# EAGLE design pcb01_control (EAGLE 6.4)
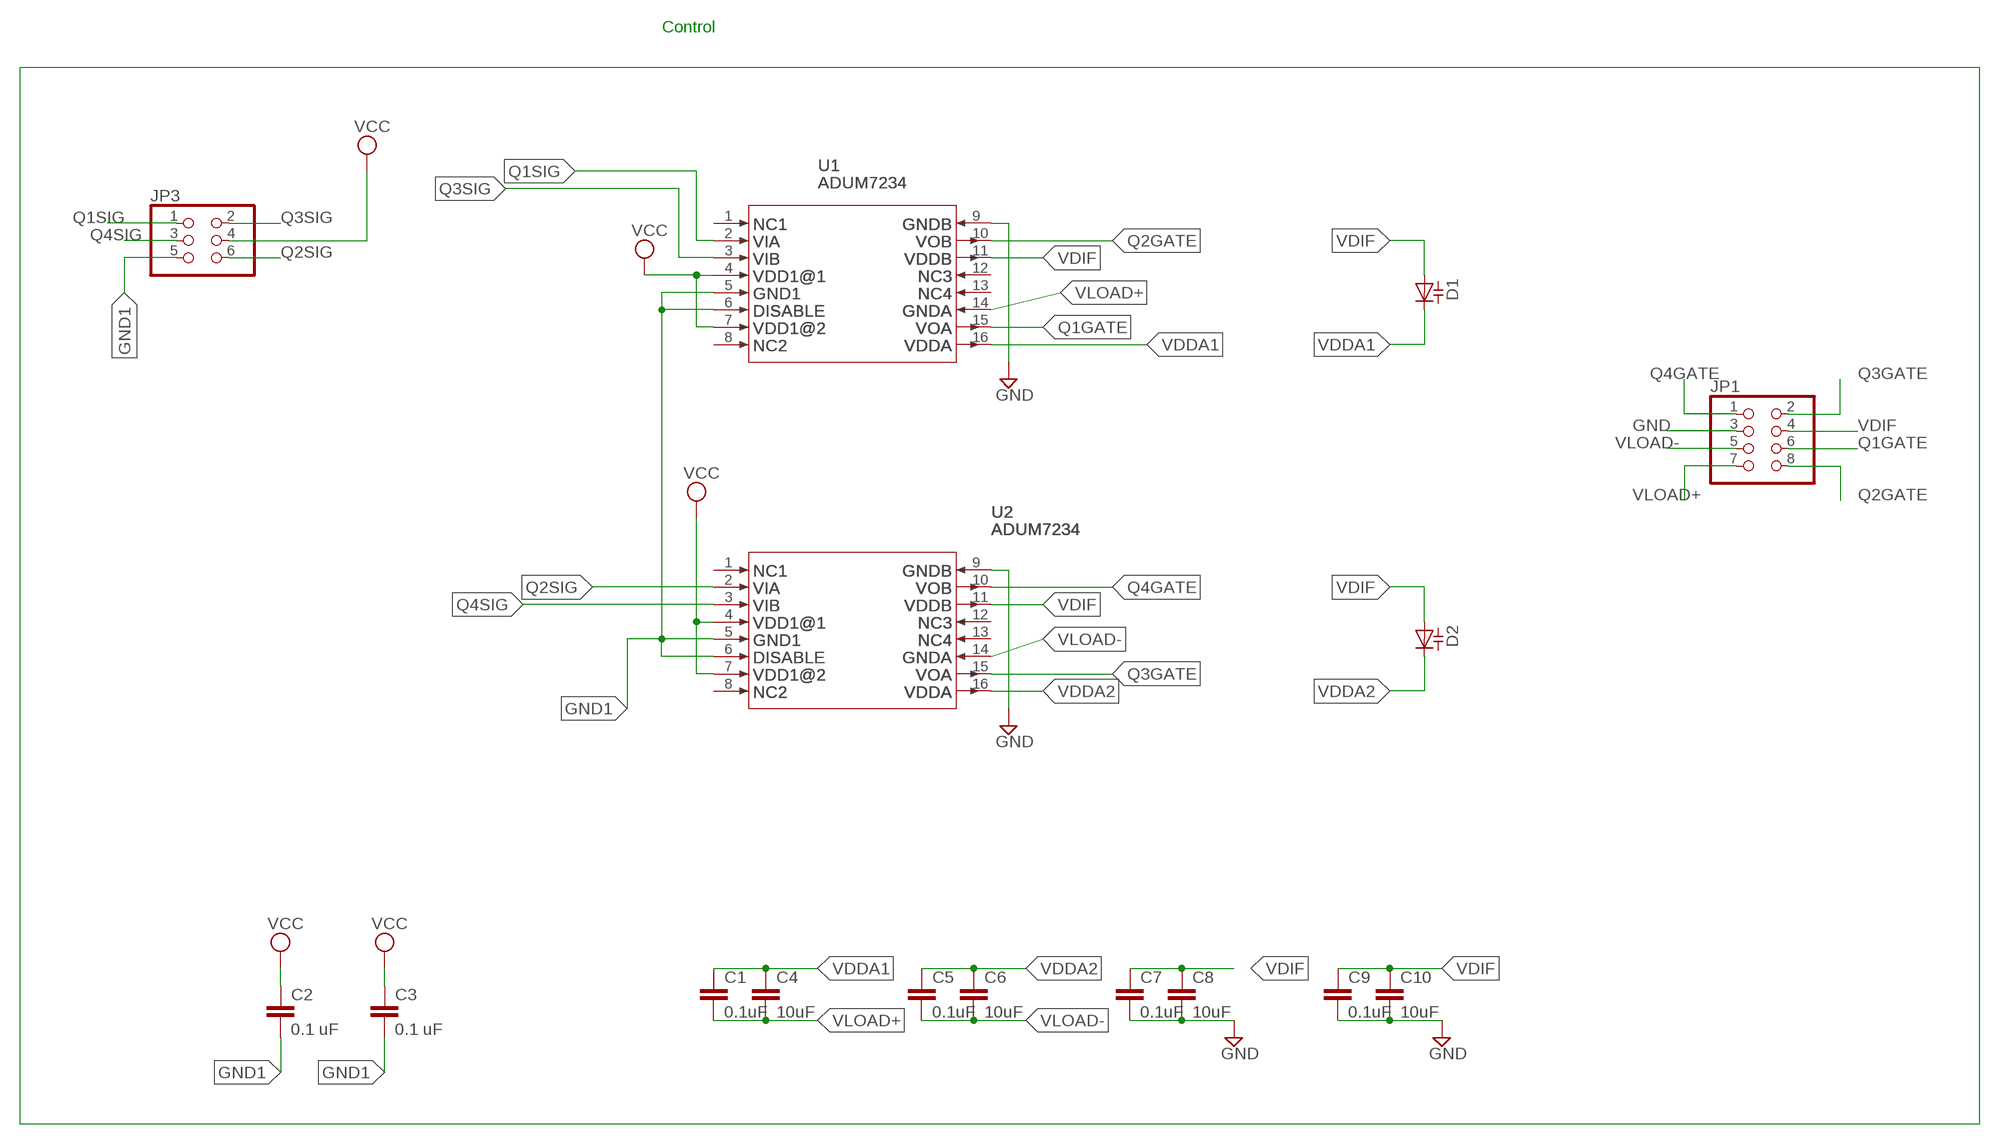
[diagram p0: schematic, sheet 1]

## Parts
C1  0.1uF  C-EUC0805  [C0805]
C2  0.1 uF  C-EUC0805  [C0805]
C3  0.1 uF  C-EUC0805  [C0805]
C4  10uF  C-EUC0805  [C0805]
C5  0.1uF  C-EUC0805  [C0805]
C6  10uF  C-EUC0805  [C0805]
C7  0.1uF  C-EUC0805  [C0805]
C8  10uF  C-EUC0805  [C0805]
C9  0.1uF  C-EUC0805  [C0805]
C10  10uF  C-EUC0805  [C0805]
D1  DIODE_CAPACITANCE-SOD523  [SOD523]
D2  DIODE_CAPACITANCE-SOD523  [SOD523]
JP1  PINHD-2X4  [2X04]
JP3  PINHD-2X3  [2X03]
U1  ADUM7234  [16_SOIC]
U2  ADUM7234  [16_SOIC]

## Nets
GND: C7.2 C8.2 C9.2 C10.2 JP1.3 U1.9 U2.9
GND1: C2.2 C3.2 JP3.5 U1.5 U1.6 U2.5 U2.6
Q1GATE: JP1.6 U1.15
Q1SIG: JP3.1 U1.2
Q2GATE: JP1.8 U1.10
Q2SIG: JP3.6 U2.2
Q3GATE: JP1.2 U2.15
Q3SIG: JP3.2 U1.3
Q4GATE: JP1.1 U2.10
Q4SIG: JP3.3 U2.3
VCC: C2.1 C3.1 JP3.4 U1.4 U1.7 U2.4 U2.7
VDDA1: C1.1 C4.1 D1.C U1.16
VDDA2: C5.1 C6.1 D2.C U2.16
VDIF: C7.1 C8.1 C9.1 C10.1 D1.A D2.A JP1.4 U1.11 U2.11
VLOAD+: C1.2 C4.2 JP1.7 U1.14
VLOAD-: C5.2 C6.2 JP1.5 U2.14
Unconnected: U1.1 U1.8 U1.12 U1.13 U2.1 U2.8 U2.12 U2.13

## Notes on the sheet
- Control

## Library data of the parts
C1 C4-C10 = resistor:C-EU: CAPACITOR, European symbol
C2 C3 = rcl:C-EU: CAPACITOR, European symbol
D1 D2 = diode:DIODE_CAPACITANCE-: Capacity DIODE
JP1 = adafruit:PINHD-2X4: PIN HEADER
JP3 = pinhead:PINHD-2X3: PIN HEADER
U1 U2 = fablibr:ADUM7234: Analog Devices 7234 Half bridge driver ADuM7234 in package SOIC 16

## Board
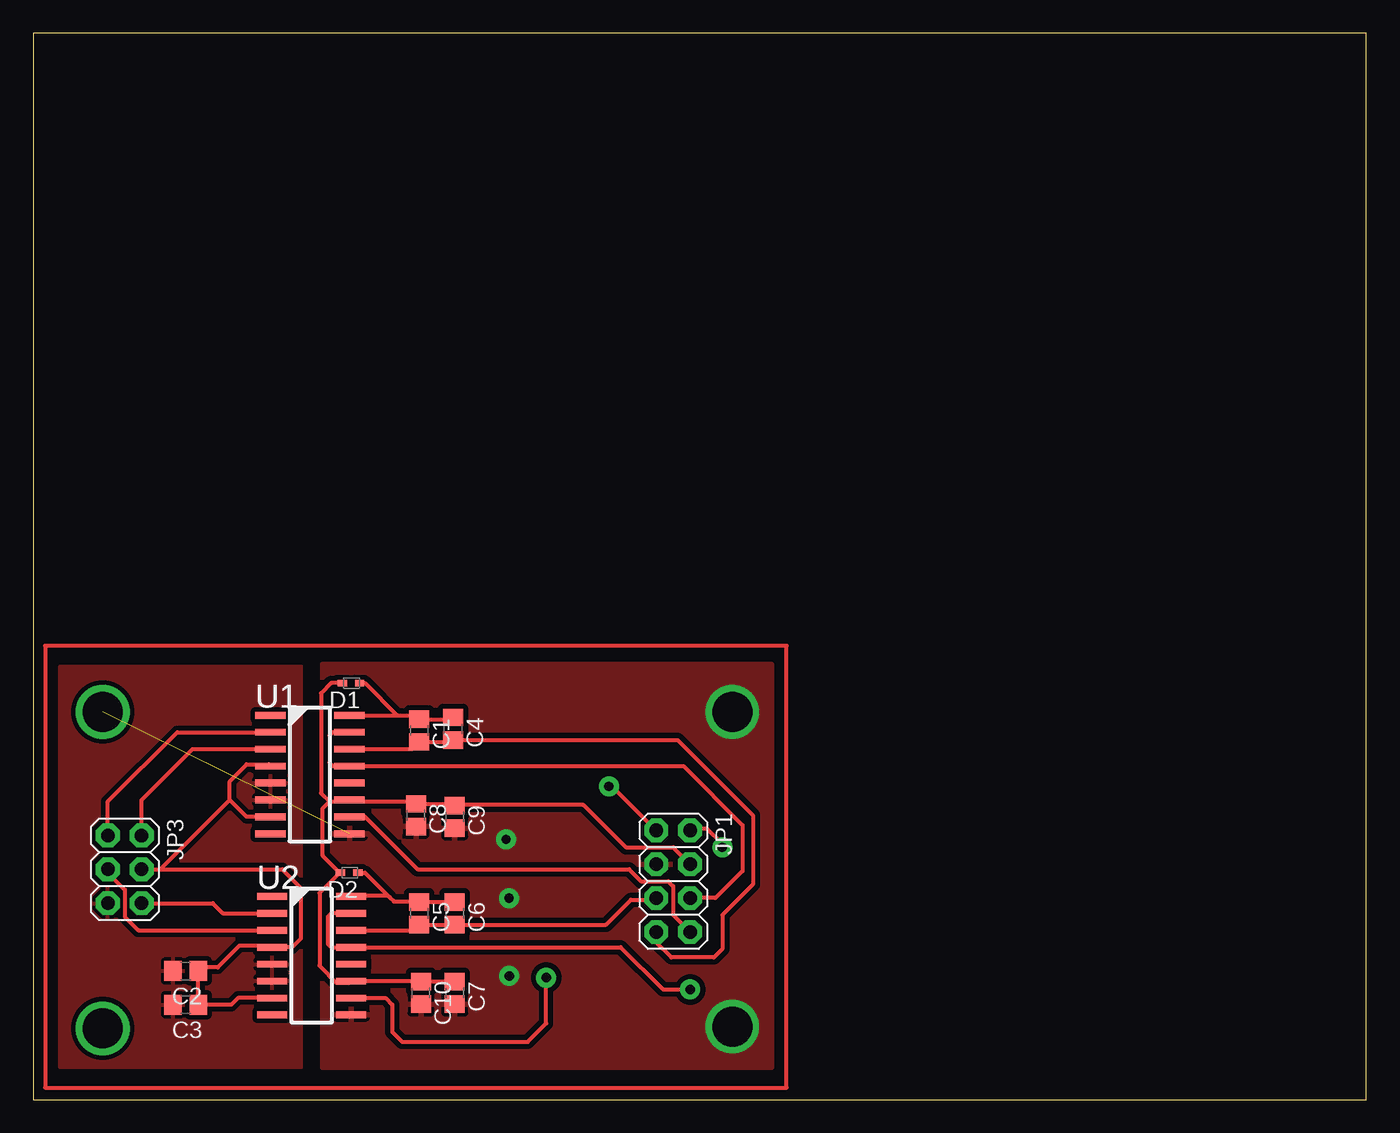
[diagram p1: board, top side]
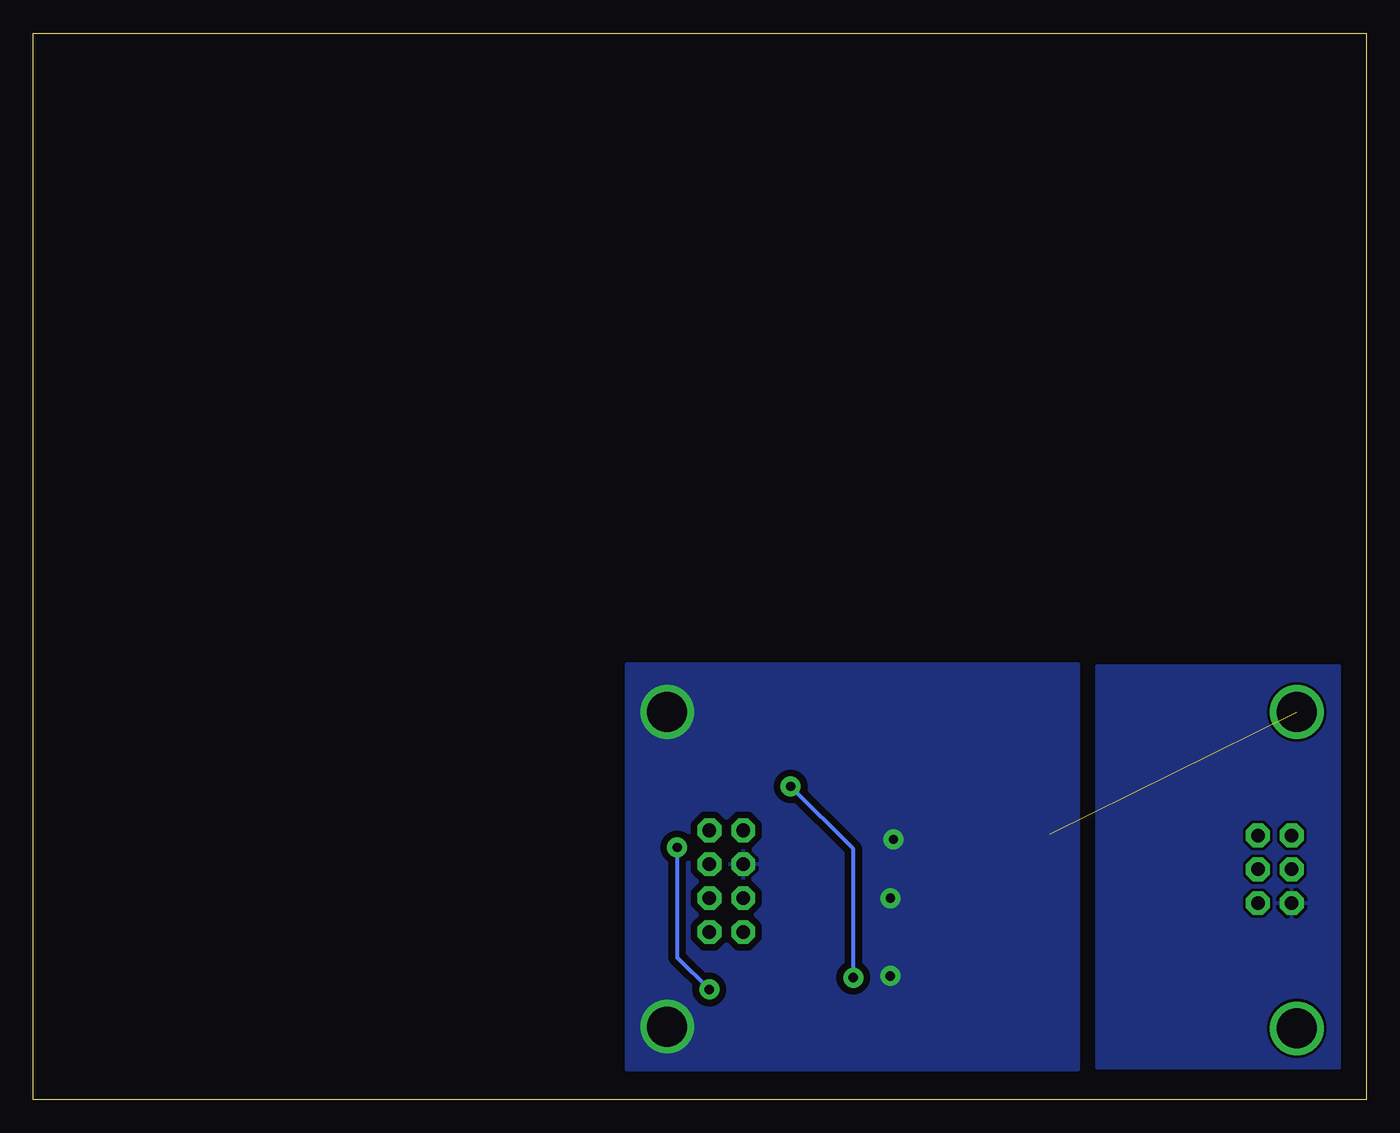
[diagram p2: board, bottom side, seen from below]

Size 100 x 80 mm. Coordinates in mm from the lower left corner, seen from the top.
Outline: 0,0 100,0 100,80 0,80 0,0
Copper layers (1*16): Top 0.035mm / dielectric 1.5mm / Bottom 0.035mm
Design rules "default *": minimum track width 10mil, minimum drill 24mil, track to track 8mil, track to pad 8mil, pad to pad 8mil, via to via 8mil, smd to smd 8mil, copper to edge 40mil, drill to drill 8mil, minimum pad ring 15mil, minimum via ring 8mil, stop-mask expansion 4mil, vias tented up to drill 0mil, thermal gap 10mil

### Footprints (pad centres in the part's own frame; a part is rotated, then mirrored left to right if it is on the bottom)
C0805 = smd 1.3 x 1.5: 1 -0.85,0; 2 0.85,0
C0805' = smd 1.3 x 1.5: 1 -0.95,0; 2 0.95,0
SOD523 = smd 0.7 x 0.5: A 0.7,0; C -0.6,0
2X04 = drill 1.016 pad 1.676 octagon: 1 -3.81,-1.27; 2 -3.81,1.27; 3 -1.27,-1.27; 4 -1.27,1.27; 5 1.27,-1.27; 6 1.27,1.27; 7 3.81,-1.27; 8 3.81,1.27
2X03 = drill 1.016 octagon: 1 -2.54,-1.27; 2 -2.54,1.27; 3 0,-1.27; 4 0,1.27; 5 2.54,-1.27; 6 2.54,1.27
16_SOIC = smd 2.27 x 0.51: 1 -0.5,0; 2 -0.5,-1.27; 3 -0.5,-2.54; 4 -0.5,-3.81; 5 -0.5,-5.08; 6 -0.5,-6.35; 7 -0.5,-7.62; 8 -0.5,-8.89; 9 5.43,-8.89; 10 5.43,-7.62; 11 5.43,-6.35; 12 5.43,-5.08; 13 5.43,-3.81; 14 5.43,-2.54; 15 5.43,-1.27; 16 5.43,0

### Placement (x,y rotation side)
C1  28.96,27.69 270 top
C2  0.1 uF  [C0805']  11.43,9.65 180 top
C3  0.1 uF  [C0805']  11.43,7.11 180 top
C4  31.5,27.81 270 top
C5  28.96,13.97 270 top
C6  31.62,13.97 270 top
C7  31.62,8 270 top
C8  28.7,21.34 270 top
C9  31.62,21.21 270 top
C10  29.08,8 270 top
D1  23.88,31.24 180 top
D2  23.75,17.02 180 top
JP1  48.01,16.38 270 top
JP3  6.86,17.27 270 top
U1  18.29,28.83 0 top
U2  18.41,15.24 0 top

### Tracks (layer width: path | path; a pad name or v marks a point on that pad's centre or on a via)
GND  (via drill 0.7 pad 1.5, 3 pad 3)  (1 unrouted)
  other vias: 5.21,29.08 35.7,15.1 35.71,9.27 35.47,19.52 52.45,29.08 52.45,5.46
  pour Top (isolate 0.4): 21.72,32.64 21.72,2.41 55.37,2.41 55.37,32.64
  pour Bottom (isolate 0.5): 55.37,32.64 55.5,32.64 55.5,2.29 21.59,2.29 21.59,32.64
GND1
  pour Top (isolate 0.35): 20.07,32.51 20.07,2.41 2.03,2.41 2.03,32.51
  pour Bottom: 2.03,32.51 20.19,32.51 20.19,2.41 2.03,2.41
N$2
  Top 0.3: 0.89,34.04 0.89,0.89 56.52,0.89 56.52,34.04 0.89,34.04
N$3  (via drill 3)
  other vias: 5.21,5.33
Q1GATE
  Top 0.3: U1.15 22.48,27.56 22.23,27.3 22.23,25.27 22.48,25.02 48.77,25.02 53.21,20.57 53.21,17.14 51.18,15.11 JP1.6 49.4,14.99
Q1SIG
  Top 0.3: JP3.1 5.59,22.35 10.79,27.56 U1.2
Q2GATE
  Top 0.3: U1.10 24.89,21.21 28.83,17.27 44.7,17.27 45.59,16.38 47.62,16.38 48.01,16 48.01,13.84 JP1.8
Q2SIG
  Top 0.3: JP3.6 13.46,14.73 14.22,13.97 U2.2
Q3GATE  (via drill 0.7 pad 1.5)
  Top 0.3: U2.15 22.35,13.97 22.1,13.72 22.1,11.68 22.35,11.43 44.07,11.43 47.24,8.26 v49.28,8.26 | v51.69,18.92 51.69,19.18 50.55,20.32 49.4,20.32 JP1.2
  Bottom 0.3: v51.69,18.92 51.69,10.67 v49.28,8.26
Q3SIG
  Top 0.3: JP3.2 8.13,22.48 11.94,26.29 U1.3 | U1.3 18.16,26.29 18.29,26.16 17.91,26.16 U1.3
Q4GATE  (via drill 0.7 pad 1.5)
  Top 0.3: U2.10 26.42,7.62 26.92,7.11 26.92,5.08 27.69,4.32 37.08,4.32 38.48,5.71 v38.48,9.14 | v43.18,23.5 43.43,23.5 JP1.1
  Bottom 0.3: v38.48,9.14 38.48,18.8 v43.18,23.5
Q4SIG
  Top 0.3: JP3.3 5.59,17.02 6.86,15.75 6.86,13.72 7.87,12.7 U2.3
VCC
  Top 0.3: U1.7 16,21.21 14.73,22.48 | 14.73,22.48 14.73,23.88 16,25.15 17.66,25.15 U1.4 | JP3.4 9.53,17.27 | 9.53,17.27 14.73,22.48 | 9.53,17.27 18.67,17.27 20.07,15.88 20.07,12.06 19.43,11.43 U2.4 17.79,11.56 15.49,11.56 13.84,9.91 12.63,9.91 C2.1 C3.1 14.86,7.11 15.37,7.62 U2.7
VDDA1
  Top 0.3: C4.1 31.37,28.54 C1.1 28.66,28.83 27.3,28.83 | U1.16 27.3,28.83 | D1.C 24.89,31.24 27.3,28.83
VDDA2
  Top 0.3: U2.16 23.84,15.34 26.57,15.34 | C6.1 C5.1 28.92,14.86 27.05,14.86 26.73,15.18 26.57,15.34 | D2.C 24.89,17.02 26.57,15.34
VDIF
  Top 0.3: 22.23,22.35 23.59,22.35 | 23.59,22.35 U1.11 | 23.59,22.35 28.54,22.35 C8.1 31.5,22.19 C9.1 | C9.1 31.79,22.06 31.88,21.97 | 22.99,17.02 21.72,18.29 21.72,21.84 22.23,22.35 | C7.1 C10.1 29.04,8.89 U2.11 23.72,8.76 22.73,8.76 21.46,10.03 21.46,15.49 22.99,17.02 | D2.A 22.99,17.02 | D1.A 22.35,31.24 21.59,30.48 21.59,22.99 22.23,22.35 | JP1.4 48.01,18.92 44.45,18.92 41.27,22.1 31.66,22.1 C9.1
VLOAD+
  Top 0.3: U1.14 28.41,26.29 C1.2 31.37,26.84 C4.2 48.35,26.96 53.98,21.34 53.98,16.13 51.69,13.84 51.69,11.3 51.05,10.67 47.88,10.67 46.74,11.81 JP1.7
VLOAD-
  Top 0.3: U2.14 28.54,12.7 C5.2 C6.2 42.97,13.12 44.83,14.99 46.61,14.99 JP1.5